# EAGLE design DS18B20Test4 (EAGLE 7.3.0)
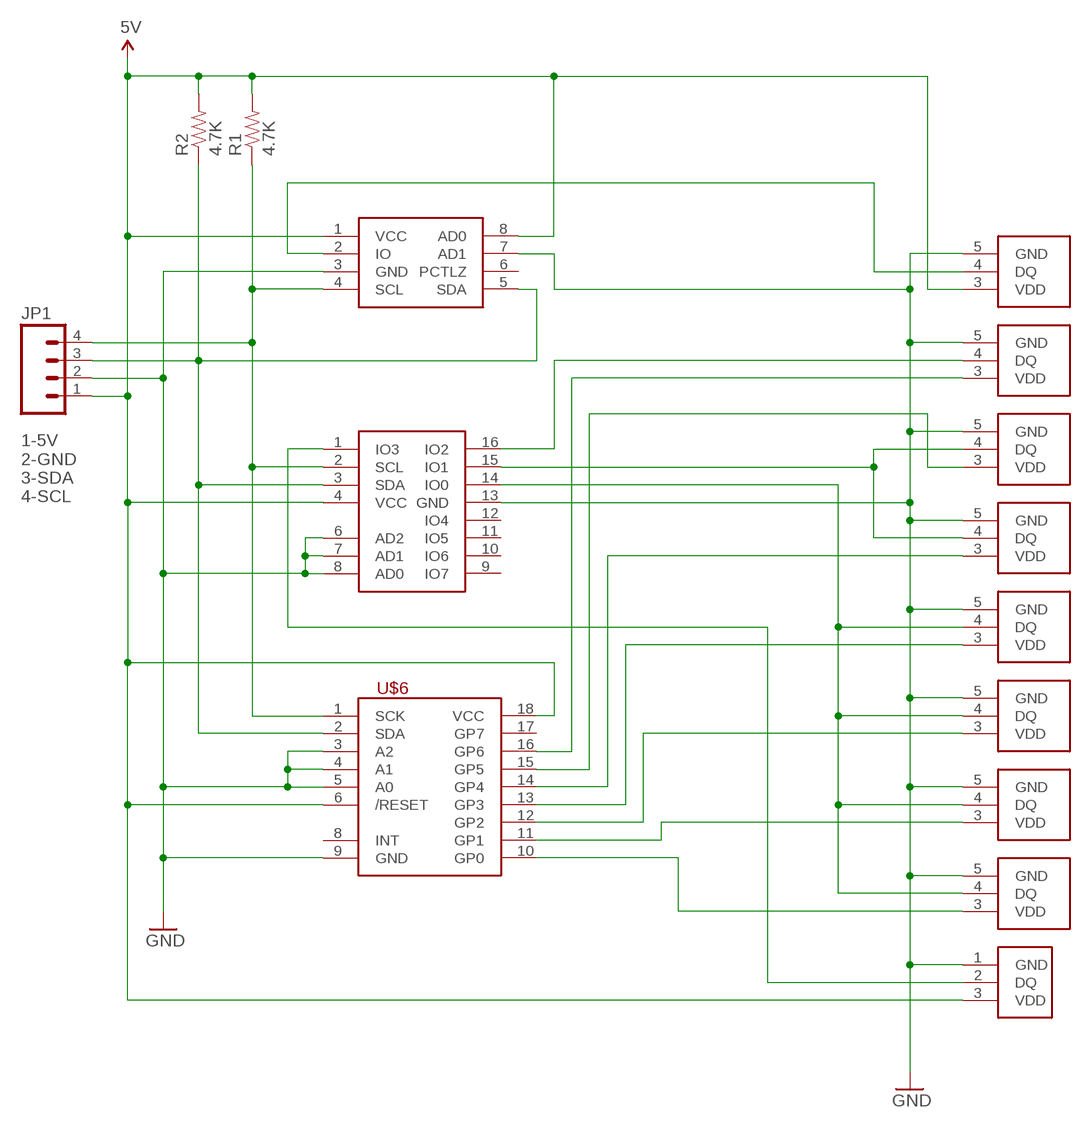
[diagram p0: schematic, sheet 1]

## Parts
JP1  M04PTH  [1X04]
R1  4.7K  RES-4.7K-0603  [0603-RES]
R2  4.7K  RES-4.7K-0603  [0603-RES]
U$1  DS2482-100  [8-SOIC-MAXIM]
U$2  DS2482-800  [16-SOIC-MAXIM]
U$3  TERMBLOCK-1WIRE  [TERMBLOCK-1WIRE]
U$4  DS18B208-SOIC  [DS18B20-S0]
U$5  DS18B208-SOIC  [DS18B20-S0]
U$6  MCP23008  [SOIC-18-W-MAXIM]
U$7  DS18B208-SOIC  [DS18B20-S0]
U$8  DS18B208-SOIC  [DS18B20-S0]
U$9  DS18B208-SOIC  [DS18B20-S0]
U$10  DS18B208-SOIC  [DS18B20-S0]
U$11  DS18B208-SOIC  [DS18B20-S0]
U$12  DS18B208-SOIC  [DS18B20-S0]

## Nets
5V: JP1.1 R1.2 R2.2 U$1.1(VCC) U$1.8(AD0) U$2.4(VCC) U$3.3(VDD) U$4.3(VDD) U$6.6(/RESET) U$6.18(VCC)
GND: JP1.2 U$1.3(GND) U$1.7(AD1) U$2.6(AD2) U$2.7(AD1) U$2.8(AD0) U$2.13(GND) U$3.1(GND) U$4.5(GND) U$5.5(GND) U$6.3(A2) U$6.4(A1) U$6.5(A0) U$6.9(GND) U$7.5(GND) U$8.5(GND) U$9.5(GND) U$10.5(GND) U$11.5(GND) U$12.5(GND)
N$1: U$1.2(IO) U$4.4(DQ)
N$2: U$2.16(IO2) U$5.4(DQ)
N$4: U$2.15(IO1) U$7.4(DQ) U$8.4(DQ)
N$6: U$2.14(IO0) U$9.4(DQ) U$10.4(DQ) U$11.4(DQ) U$12.4(DQ)
N$7: U$2.1(IO3) U$3.2(DQ)
N$8: U$5.3(VDD) U$6.16(GP6)
N$9: U$6.15(GP5) U$7.3(VDD)
N$10: U$6.14(GP4) U$8.3(VDD)
N$11: U$6.13(GP3) U$9.3(VDD)
N$12: U$6.12(GP2) U$10.3(VDD)
N$13: U$6.11(GP1) U$11.3(VDD)
N$14: U$6.10(GP0) U$12.3(VDD)
SCL: JP1.4 R1.1 U$1.4(SCL) U$2.2(SCL) U$6.1(SCK)
SDA: JP1.3 R2.1 U$1.5(SDA) U$2.3(SDA) U$6.2(SDA)
Unconnected: U$1.6(PCTLZ) U$2.9(IO7) U$2.10(IO6) U$2.11(IO5) U$2.12(IO4) U$6.8(INT) U$6.17(GP7)

## Notes on the sheet
- 1-5V
  2-GND
  3-SDA
  4-SCL

## Library data of the parts
JP1 = rickk2:M04: Header 4 Standard 4-pin 0.1" header. Use with straight break away headers (SKU : PRT-00116), right angle break away headers (PRT-00553), swiss pins (PRT-00743), machine pins (PRT-00117), and female headers (PRT-00115). Molex polarized connector foot print use with SKU : PRT-08231 with associated crimp pins and housings. 1MM SMD Version SKU: PRT-10208
R1 R2 = rickk2:RES-4.7K-0603: RES SMD 4.7K OHM 5% 1/4W 0603 $ 0.11 https://www.digikey.com/product-detail/en/panasonic-electronic-components/ERJ-PA3J472V/P4.7KBZCT-ND/5036332 Panasonic
U$1 = rickk2:DS2482-100: IC BRIDGE I2C TO 1-WIRE 8-SOIC $1.54 1-Wire® Bridge, 1-Wire® to I²C I²C Interface 8-SOIC https://www.digikey.com/product-detail/en/maxim-integrated/DS2482S-100-/DS2482S-100--ND/1197435
U$2 = rickk2:DS2482-800: IC I2C TO 1WIRE BRIDGE 16SOIC $7.70 1-Wire® Bridge, 1-Wire® to I²C I²C Interface, 8-channel 16-SO https://www.digikey.com/product-detail/en/maxim-integrated/DS2482S-800-/DS2482S-800--ND/1197437
U$3 = rickk2:TERMBLOCK-1WIRE: TERM BLOCK 3.5MM VERT 3POS PCB $1.00 3 Position Wire to Board Terminal Block Horizontal with Board 0.138" (3.50mm) Through Hole 10A 16-26 AWG Top screw, vertical, blue https://www.digikey.com/product-detail/en/on-shore-technology-inc/OSTTE030161/ED2636-ND/614585
U$4 U$5 U$7-U$12 = rickk2:DS18B20
U$6 = rickk2:MCP23008: IC I/O EXPANDER I2C 8B 18SOIC $1.08 https://www.digikey.com/product-detail/en/microchip-technology/MCP23008T-E-SO/MCP23008T-E-SOCT-ND/5358243

## Board
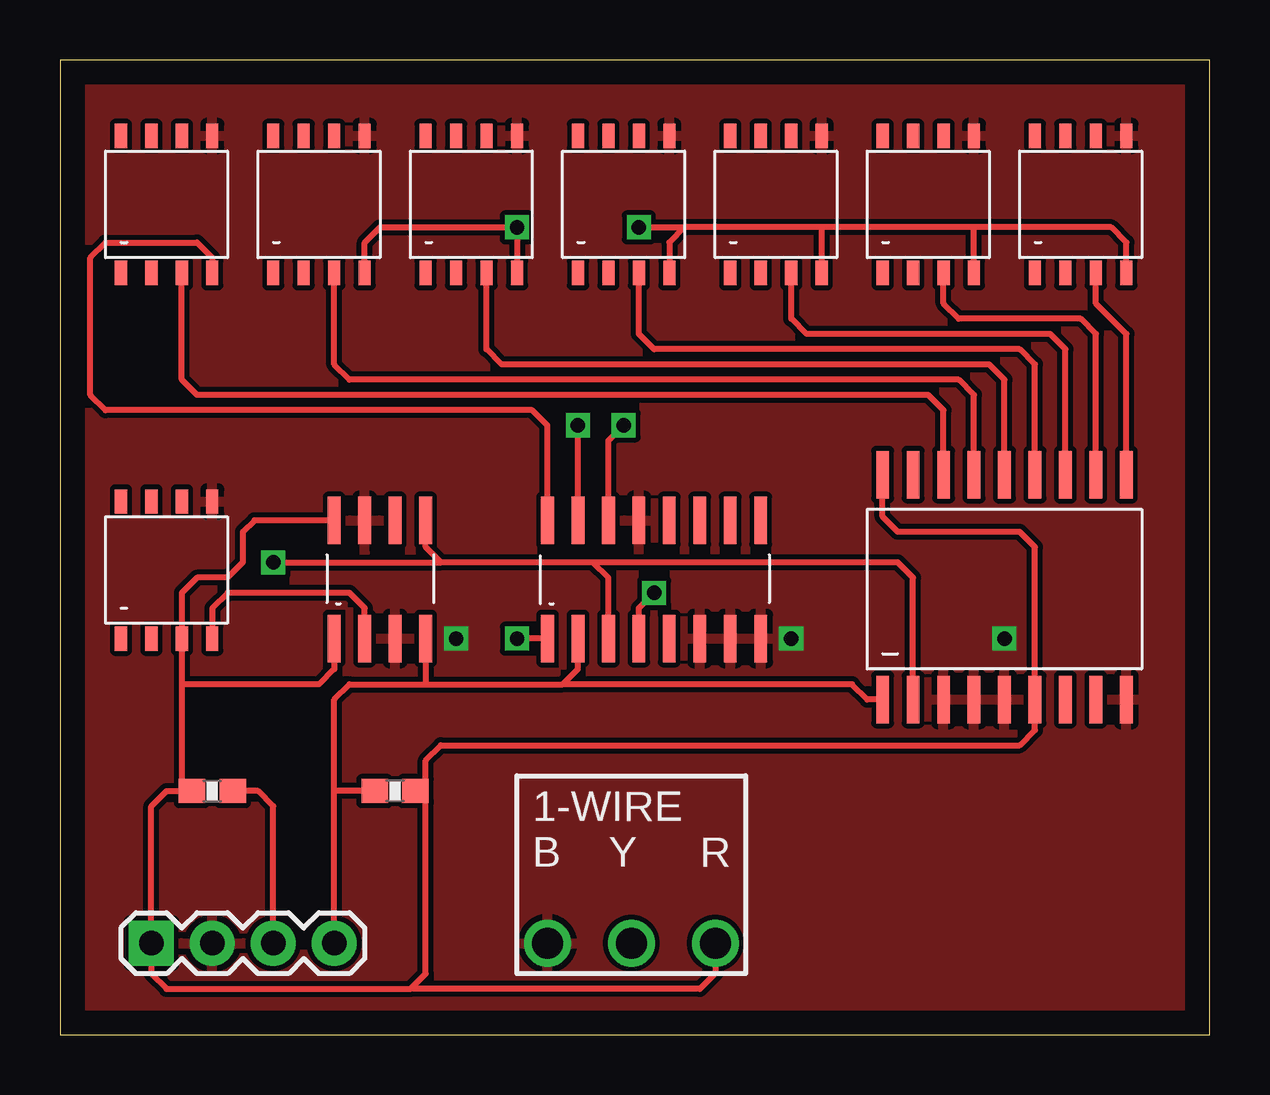
[diagram p1: board, top side]
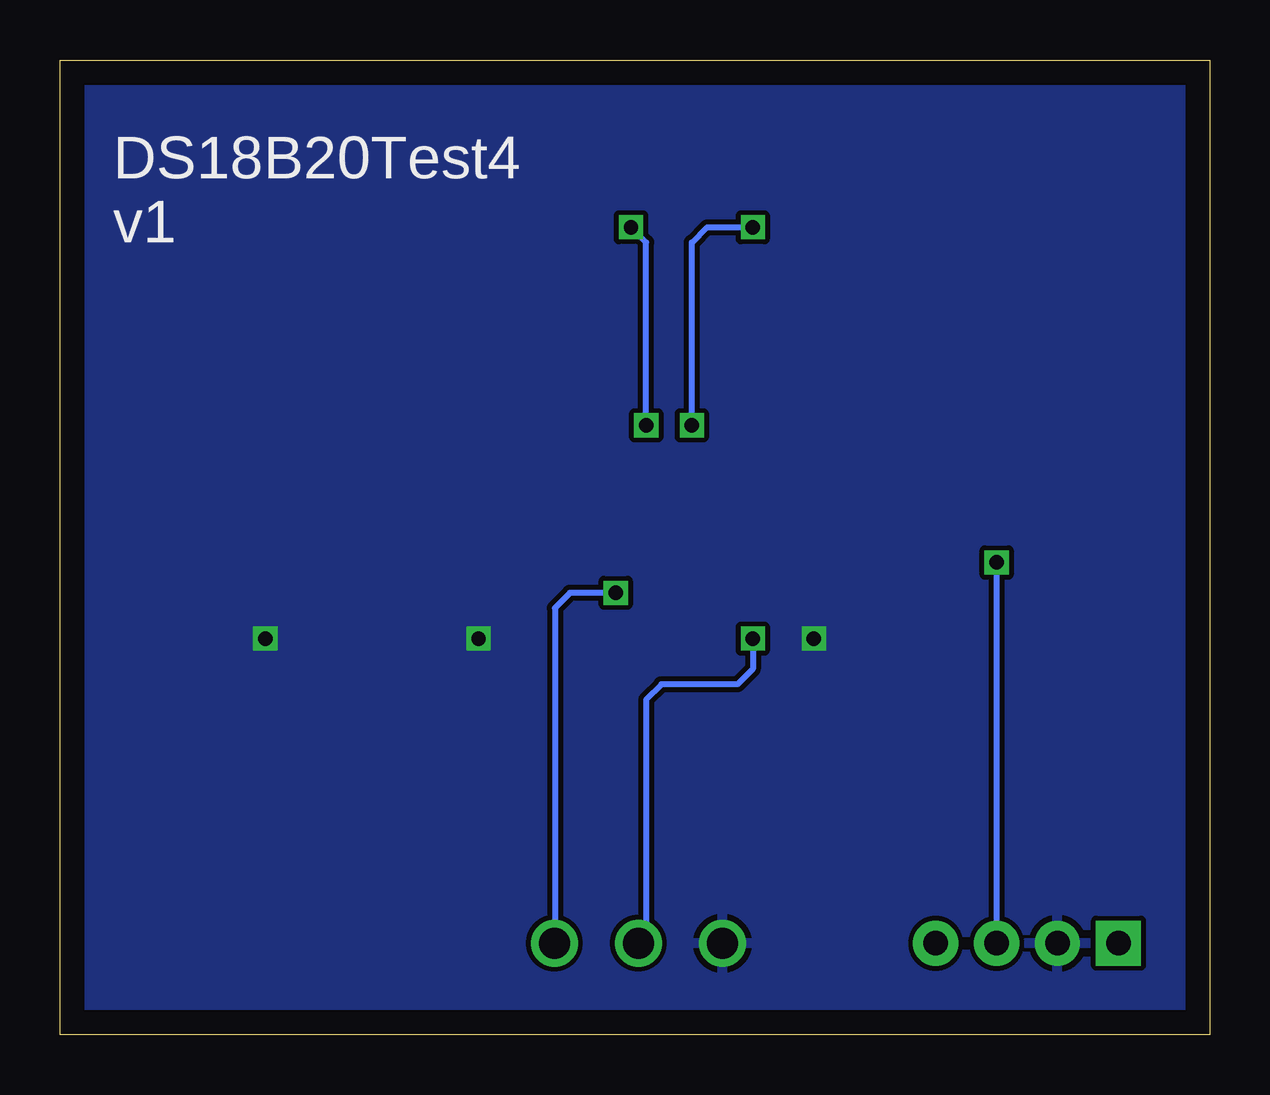
[diagram p2: board, bottom side, seen from below]

Size 47.93 x 40.63 mm. Coordinates in mm from the lower left corner, seen from the top.
Outline: 0,0 47.93,0 47.93,40.63 0,40.63 0,0
Copper layers (1*16): Top 0.035mm / dielectric 1.5mm / Bottom 0.035mm
Design rules "default": minimum track width 10mil, minimum drill 24mil, track to track 8mil, track to pad 8mil, pad to pad 8mil, via to via 8mil, smd to smd 8mil, copper to edge 40mil, drill to drill 8mil, minimum pad ring 10mil, minimum via ring 8mil, stop-mask expansion 4mil, vias tented up to drill 0mil, thermal gap 10mil

### Footprints (pad centres in the part's own frame; a part is rotated, then mirrored left to right if it is on the bottom)
1X04 = drill 1.016 pad 1.88 square: 1 0,0 | drill 1.016 pad 1.88: 2 2.54,0; 3 5.08,0; 4 7.62,0
0603-RES = smd 1.1 x 1: 1 -0.85,0; 2 0.85,0
8-SOIC-MAXIM = smd 0.53 x 1.98: 1 0,0; 2 1.27,0; 3 2.54,0; 4 3.81,0; 5 3.81,4.93; 6 2.54,4.93; 7 1.27,4.93; 8 0,4.93
16-SOIC-MAXIM = smd 0.53 x 1.98: 1 0,0; 2 1.27,0; 3 2.54,0; 4 3.81,0; 5 5.08,0; 6 6.35,0; 7 7.62,0; 8 8.89,0; 9 8.89,4.93; 10 7.62,4.93; 11 6.35,4.93; 12 5.08,4.93; 13 3.81,4.93; 14 2.54,4.93; 15 1.27,4.93; 16 0,4.93
TERMBLOCK-1WIRE = drill 1.3: 1 0,0; 2 3.5,0; 3 7,0
DS18B20-S0 = smd 0.508 x 1.016: 1 0,0; 2 1.27,0; 3 2.54,0; 4 3.81,0; 5 3.81,5.715; 6 2.54,5.715; 7 1.27,5.715; 8 0,5.715
SOIC-18-W-MAXIM = smd 0.533 x 1.981: 1 0,0; 2 1.27,0; 3 2.54,0; 4 3.81,0; 5 5.08,0; 6 6.35,0; 7 7.62,0; 8 8.89,0; 9 10.16,0; 10 10.16,9.373; 11 8.89,9.373; 12 7.62,9.373; 13 6.35,9.373; 14 5.08,9.373; 15 3.81,9.373; 16 2.54,9.373; 17 1.27,9.373; 18 0,9.373

### Placement (x,y rotation side)
JP1  3.81,3.81 0 top
R1  13.97,10.16 0 top
R2  6.35,10.16 180 top
U$1  11.43,16.51 0 top
U$2  20.32,16.51 0 top
U$3  20.32,3.81 0 top
U$4  2.54,16.51 0 top
U$5  2.54,31.75 0 top
U$6  34.29,13.97 0 top
U$7  8.89,31.75 0 top
U$8  15.24,31.75 0 top
U$9  21.59,31.75 0 top
U$10  27.94,31.75 0 top
U$11  34.29,31.75 0 top
U$12  40.64,31.75 0 top

### Tracks (layer width: path | path; a pad name or v marks a point on that pad's centre or on a via)
5V  (via drill 0.6)
  Top 0.254: 5.08,14.61 U$4.3 5.08,18.41 5.71,19.05 6.99,19.05 7.62,19.68 7.62,20.95 8.11,21.44 U$1.8 | 5.08,14.61 5.08,10.58 R2.2 4.45,10.16 3.81,9.53 JP1.1 3.81,2.54 4.45,1.91 14.61,1.91 | U$1.1 11.43,15.24 10.79,14.61 5.08,14.61 | 14.61,1.91 15.24,2.54 15.24,9.74 | 15.24,9.74 R1.2 | U$3.3 27.32,2.56 26.67,1.91 14.61,1.91 | 15.24,9.74 15.24,11.43 15.88,12.06 40.01,12.06 40.64,12.7 U$6.6 40.64,20.32 40.01,20.95 34.92,20.95 34.29,21.59 U$6.18 | U$2.4 24.13,17.78 v24.77,18.41
  Bottom 0.254: v24.77,18.41 26.67,18.41 27.3,17.78 27.3,3.83 U$3.3
GND  (via drill 0.6)
  other vias: 30.48,16.51 16.51,16.51 39.37,16.51
  pour Bottom: 0,0 0,40.64 48.26,40.64 48.26,0
  pour Top: 0,0 0,40.64 48.26,40.64 48.26,0
N$1
  Top 0.254: U$1.2 12.7,17.78 12.06,18.41 6.99,18.41 6.35,17.78 U$4.4
N$2
  Top 0.254: U$2.16 20.32,25.4 19.68,26.04 1.91,26.04 1.27,26.67 1.27,32.38 1.91,33.02 5.71,33.02 6.35,32.38 U$5.4
N$4  (via drill 0.6)
  Top 0.254: U$2.15 v21.59,25.4 | U$8.4 v19.05,33.66 13.34,33.66 12.7,33.02 U$7.4
  Bottom 0.254: v21.59,25.4 21.59,33.02 20.95,33.66 v19.05,33.66
N$6  (via drill 0.6)
  Top 0.254: U$12.4 44.45,33.02 43.81,33.66 38.1,33.66 | 38.1,33.66 31.75,33.66 | 31.75,33.66 26.04,33.66 | 26.04,33.66 25.4,33.02 U$9.4 | U$10.4 31.75,33.66 | U$11.4 38.1,33.66 | U$2.14 22.86,24.77 v23.5,25.4 | v24.13,33.66 26.04,33.66
  Bottom 0.254: v23.5,25.4 23.5,33.02 v24.13,33.66
N$7  (via drill 0.6)
  Top 0.254: U$2.1 v19.05,16.51
  Bottom 0.254: v19.05,16.51 19.05,15.24 19.68,14.61 22.86,14.61 23.5,13.97 23.5,4.13 U$3.2
N$8
  Top 0.254: U$6.16 36.83,26.04 36.2,26.67 5.71,26.67 5.08,27.3 U$5.3
N$9
  Top 0.254: U$6.15 38.1,26.67 37.47,27.3 12.06,27.3 11.43,27.94 U$7.3
N$10
  Top 0.254: U$6.14 39.37,27.3 38.73,27.94 18.41,27.94 17.78,28.57 U$8.3
N$11
  Top 0.254: U$6.13 40.64,27.94 40.01,28.57 24.77,28.57 24.13,29.21 U$9.3
N$12
  Top 0.254: U$6.12 41.91,28.57 41.27,29.21 31.11,29.21 30.48,29.84 U$10.3
N$13
  Top 0.254: U$6.11 43.18,29.21 42.55,29.84 37.47,29.84 36.83,30.48 U$11.3
N$14
  Top 0.254: U$6.10 44.45,29.21 43.18,30.48 U$12.3
SCL
  Top 0.254: JP1.4 11.43,10.16 | 11.43,10.16 11.43,13.97 12.06,14.61 15.24,14.61 | 15.24,14.61 20.95,14.61 | 20.95,14.61 21.59,15.24 U$2.2 | U$1.4 15.24,14.61 | U$6.1 33.66,13.97 33.02,14.61 20.95,14.61 | R1.1 11.43,10.16
SDA  (via drill 0.6)
  Top 0.254: U$2.3 22.86,19.05 22.23,19.68 | 22.23,19.68 15.88,19.68 | 15.88,19.68 15.24,20.32 U$1.5 | v8.89,19.68 15.88,19.68 | U$6.2 35.56,19.05 34.92,19.68 22.23,19.68 | JP1.3 8.89,9.53 8.26,10.16 R2.1
  Bottom 0.254: v8.89,19.68 JP1.3

### Text on the board
bPlace: DS18B20Test4 / v1